# Altium schematic sheet CONN.SchDoc: =ProjectName
size A4; CheckedBy: DatNB; Author: Ven; CompanyName: Nacentech; Organization: IMET
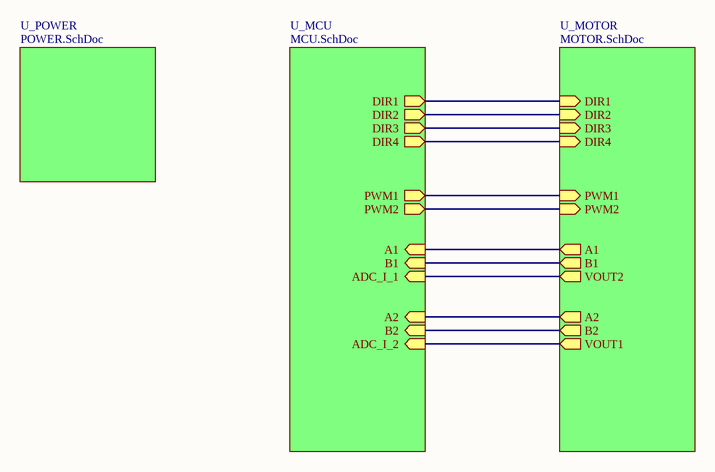
[diagram p0: CONN.SchDoc]

## Sub-sheets
U_MCU = MCU.SchDoc: DIR1 (out), DIR2 (out), DIR3 (out), DIR4 (out), A1 (in), B1 (in), ADC_I_1 (in), PWM1 (out), PWM2 (out), ADC_I_2 (in), A2 (in), B2 (in)
U_MOTOR = MOTOR.SchDoc: DIR1 (in), DIR2 (in), DIR3 (in), DIR4 (in), A1 (out), B1 (out), A2 (out), B2 (out), VOUT2 (out), VOUT1 (out), PWM2 (in), PWM1 (in)
U_POWER = POWER.SchDoc: no entries

## Nets
(unnamed): sheet U_MCU/DIR1, sheet U_MOTOR/DIR1
(unnamed): sheet U_MCU/DIR2, sheet U_MOTOR/DIR2
(unnamed): sheet U_MCU/DIR3, sheet U_MOTOR/DIR3
(unnamed): sheet U_MCU/DIR4, sheet U_MOTOR/DIR4
(unnamed): sheet U_MCU/A1, sheet U_MOTOR/A1
(unnamed): sheet U_MCU/B1, sheet U_MOTOR/B1
(unnamed): sheet U_MCU/ADC_I_1, sheet U_MOTOR/VOUT2
(unnamed): sheet U_MCU/PWM1, sheet U_MOTOR/PWM1
(unnamed): sheet U_MCU/PWM2, sheet U_MOTOR/PWM2
(unnamed): sheet U_MCU/ADC_I_2, sheet U_MOTOR/VOUT1
(unnamed): sheet U_MCU/A2, sheet U_MOTOR/A2
(unnamed): sheet U_MCU/B2, sheet U_MOTOR/B2

## Notes on the sheet
- Project:
- Page Contents:
- Size:
- Date:
- A4
- Checked by:
- Time:
- Revision:
- Sheet
- of
- File: